# Altium schematic sheet Relè Cape.SchDoc
size A4
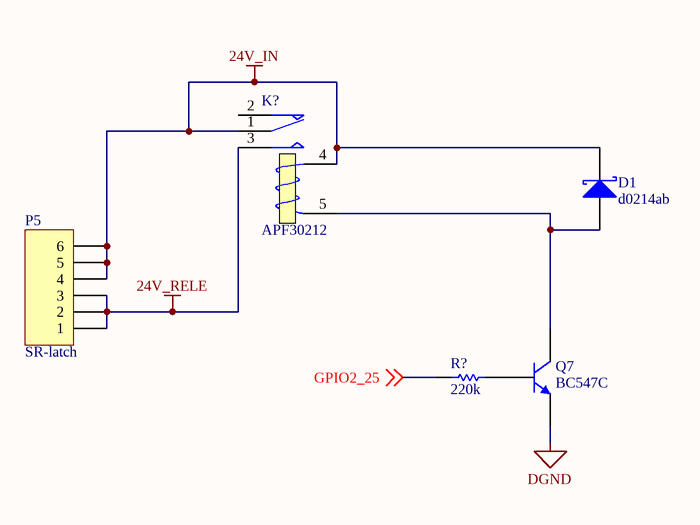
[diagram p0: Relè Cape.SchDoc]

## Parts
D1  d0214ab  [SMB]
K?  APF30212  [MODULE5B]
P5  SR-latch  [HDR1X6]
Q7  BC547C  [SOT-23B_N]
R?  220k  [AXIAL-0.3]

## Nets
24V_IN: D1.2(K) K?.1(COM) K?.4(T1) P5.4 P5.5 P5.6
24V_RELE: K?.3(NO) P5.1 P5.2 P5.3
DGND: Q7.3(E)
GPIO2_25: R?.1 ; off-sheet GPIO2_25
NetD1_1: D1.1(A) K?.5(T2) Q7.1(C)
NetQ7_2: Q7.2(B) R?.2

Not connected (* = marked no-connect by the designer): K? 2(NC)

## Library data of the parts
D1 = D Schottky: Schottky Diode; Published: 8-Jun-2000; LatestRevisionDate: 17-Jul-2002; LatestRevisionNote: Re-released for DXP Platform.; PackageReference: SMB; Publisher: Altium Limited; PackageDescription: DO-214-AA/SMB; 2 C-Bend Leads; Body 5.3 x 3.6 mm, inc. leads (LxW); Code_JEDEC: DO-214-AA
K? = Relay: SPDT Relay; Published: 8-Jun-2000; LatestRevisionDate: 17-Jul-2002; LatestRevisionNote: Re-released for DXP Platform.; PackageReference: MODULE5B; Publisher: Altium Limited
P5 = Header 6: Header, 6-Pin; LatestRevisionDate: 17-Jul-2002; LatestRevisionNote: Re-released for DXP Platform.; Publisher: Altium Limited
Q7 = QNPN: NPN Bipolar Transistor; Published: 8-Jun-2000; LatestRevisionDate: 29-May-2009; LatestRevisionNote: IPC-7351 Footprint Added.; PackageVersion: Aug-1999; PackageReference: SOT-23B; Publisher: Altium Limited; PackageDescription: 3-Pin SOT-23 Package 0.95 mm Pitch, 2.4 mm Lead Span
R? = Res1: Resistor; Value: 1K; Published: 8-Jun-2000; LatestRevisionDate: 17-Jul-2002; LatestRevisionNote: Re-released for DXP Platform.; PackageReference: AXIAL-0.3; Publisher: Altium Limited; PackageDescription: Axial Device, Thru-Hole; 2 Leads; 0.3 in Pin Spacing